# Altium project EEG.PrjPcb
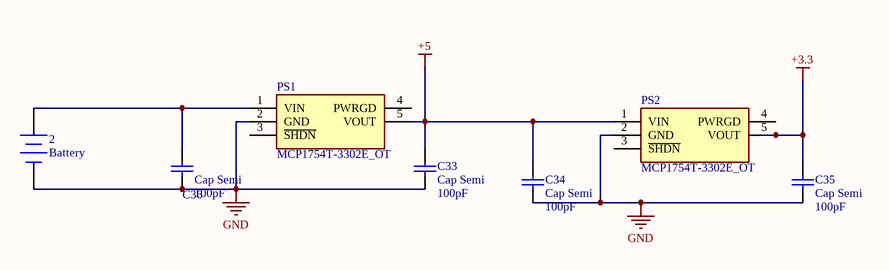
[diagram p0: Power.SchDoc]
3 sheets, 73 parts. Net scope: global (net labels, ports and power ports of the same name join across sheets).
Board file: PCB3.PcbDoc
Sheets:
  Power.SchDoc
  MCU.SchDoc
  ADS1299.schdoc

## Sheet Power.SchDoc
size A

### Parts
2  Battery  [BAT-2]
C33  Cap Semi  value 100pF  [0805c]
C34  Cap Semi  value 100pF  [0805c]
C35  Cap Semi  value 100pF  [0805c]
C36  Cap Semi  value 100pF  [0805c]
PS1  MCP1754T-3302E_OT  [SOT23-5]
PS2  MCP1754T-3302E_OT  [SOT23-5]

### Nets
+3.3: C35.1 PS2.5(VOUT)
+5: C33.1 C34.2 PS1.5(VOUT) PS2.1(VIN)
GND: 2.2(-) C33.2 C34.1 C35.2 C36.1 PS1.2(GND) PS2.2(GND)
Net2_1: 2.1(+) C36.2 PS1.1(VIN)

Not connected (* = marked no-connect by the designer): PS1 3(~{SHDN}) 4(PWRGD); PS2 3(~{SHDN}) 4(PWRGD)

### Library data of the parts
2 = Battery: Multicell Battery; Published: 24-Mar-1999; LatestRevisionDate: 17-Jul-2002; LatestRevisionNote: Re-released for DXP Platform.; PackageReference: BAT-2; Publisher: Altium Limited; PackageDescription: Battery; 2 Leads
C33-C36 = Cap Semi: Capacitor (Semiconductor SIM Model); Published: 8-Jun-2000; PackageReference: C1206; Publisher: Altium Limited; PackageDescription: Chip Capacitor; LatestRevisionDate: 29-May-2009; LatestRevisionNote: IPC-7351 Footprint Added.
PS1 PS2 = MCP1754T-3302E_OT: Power Supply; Manufacturer_Name: Microchip; Manufacturer_Part_Number: MCP1754T-3302E/OT; Allied_Number: 70451943; Datasheet Link: http://ww1.microchip.com/downloads/en/DeviceDoc/20002276C.pdf; Height: 1.45mm; Mouser Part Number: 579-MCP1754T3302EOT; Mouser Price/Stock: https://www.mouser.com/Search/Refine.aspx?Keyword=579-MCP1754T3302EOT; Allied Price/Stock: https://www.alliedelec.com/microchiptechnologyinc-mcp1754t-3302e-ot/70451943/

## Sheet MCU.SchDoc
size B
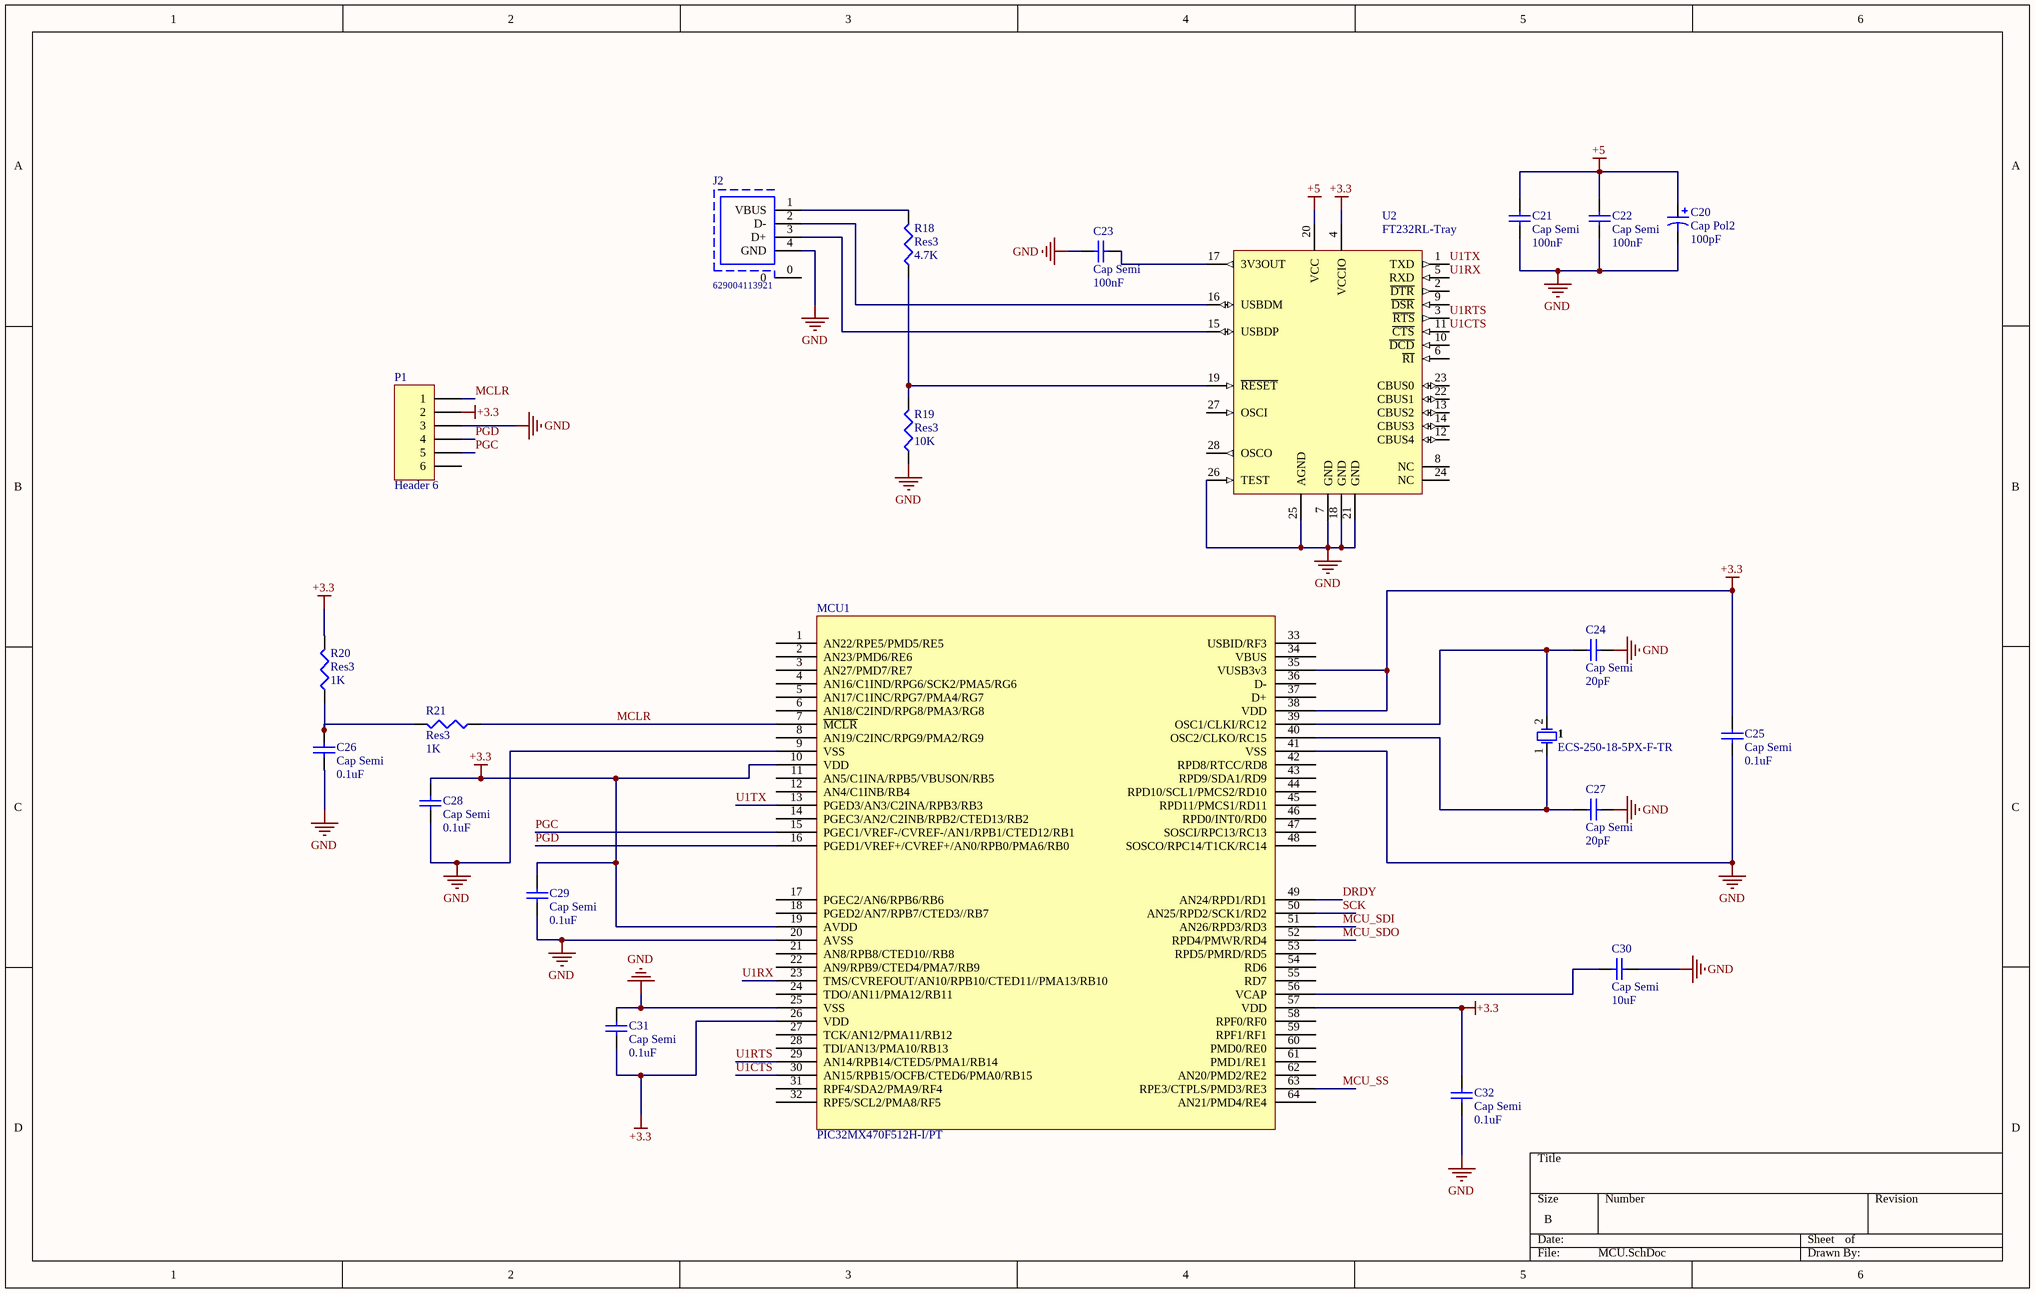
[diagram p1: MCU.SchDoc]

### Parts
1  ECS-250-18-5PX-F-TR  [XTAL/S]
C20  Cap Pol2  value 100pF  [φ6.5-1]
C21  Cap Semi  value 100nF  [0805c]
C22  Cap Semi  value 100nF  [0805c]
C23  Cap Semi  value 100nF  [0805c]
C24  Cap Semi  value 20pF  [0805c]
C25  Cap Semi  value 0.1uF  [0805c]
C26  Cap Semi  value 0.1uF  [0805c]
C27  Cap Semi  value 20pF  [0805c]
C28  Cap Semi  value 0.1uF  [0805c]
C29  Cap Semi  value 0.1uF  [0805c]
C30  Cap Semi  value 10uF  [0805c]
C31  Cap Semi  value 0.1uF  [0805c]
C32  Cap Semi  value 0.1uF  [0805c]
J2  629004113921  [USB-公头]
MCU1  PIC32MX470F512H-I/PT  [*QFP50P1200X1200X120-64N]
P1  Header 6  [HDR1X6]
R18  Res3  value 4.7K  [0805]
R19  Res3  value 10K  [0805]
R20  Res3  value 1K  [0805]
R21  Res3  value 1K  [0805]
U2  FT232RL-Tray  [SSOP-28]

### Nets
+3.3: C25.2 C28.2 C29.2 C31.1 C32.2 MCU1.10(VDD) MCU1.19(AVDD) MCU1.26(VDD) MCU1.35(VUSB3v3) MCU1.38(VDD) MCU1.57(VDD) P1.2 R20.2 U2.4(VCCIO)
+5: C20.1 C21.2 C22.2 U2.20(VCC)
GND: C20.2 C21.1 C22.1 C23.2 C24.2 C25.1 C26.1 C27.2 C28.1 C29.1 C30.2 C31.2 C32.1 J2.4(GND) MCU1.9(VSS) MCU1.20(AVSS) MCU1.25(VSS) MCU1.41(VSS) P1.3 R19.1 U2.7(GND) U2.18(GND) U2.21(GND) U2.25(AGND) U2.26(TEST)
DRDY: MCU1.49(AN24/RPD1/RD1)
MCLR: MCU1.7(~{MCLR}) P1.1 R21.1
MCU_SDI: MCU1.51(AN26/RPD3/RD3)
MCU_SDO: MCU1.52(RPD4/PMWR/RD4)
MCU_SS: MCU1.63(RPE3/CTPLS/PMD3/RE3)
PGC: MCU1.15(PGEC1/VREF-/CVREF-/AN1/RPB1/CTED12/RB1) P1.5
PGD: MCU1.16(PGED1/VREF+/CVREF+/AN0/RPB0/PMA6/RB0) P1.4
SCK: MCU1.50(AN25/RPD2/SCK1/RD2)
U1CTS: MCU1.30(AN15/RPB15/OCFB/CTED6/PMA0/RB15) U2.11(~{CTS})
U1RTS: MCU1.29(AN14/RPB14/CTED5/PMA1/RB14) U2.3(~{RTS})
U1RX: MCU1.23(TMS/CVREFOUT/AN10/RPB10/CTED11//PMA13/RB10) U2.5(RXD)
U1TX: MCU1.13(PGED3/AN3/C2INA/RPB3/RB3) U2.1(TXD)
Net1_1: 1.1 C27.1 MCU1.40(OSC2/CLKO/RC15)
Net1_2: 1.2 C24.1 MCU1.39(OSC1/CLKI/RC12)
NetC23_1: C23.1 U2.17(3V3OUT)
NetC26_2: C26.2 R20.1 R21.2
NetC30_1: C30.1 MCU1.56(VCAP)
NetJ2_1: J2.1(VBUS) R18.2
NetJ2_2: J2.2(D-) U2.16(USBDM)
NetJ2_3: J2.3(D+) U2.15(USBDP)
NetR18_1: R18.1 R19.2 U2.19(~{RESET})

Not connected (* = marked no-connect by the designer): J2 0; MCU1 1(AN22/RPE5/PMD5/RE5) 2(AN23/PMD6/RE6) 3(AN27/PMD7/RE7) 4(AN16/C1IND/RPG6/SCK2/PMA5/RG6) 5(AN17/C1INC/RPG7/PMA4/RG7) 6(AN18/C2IND/RPG8/PMA3/RG8) 8(AN19/C2INC/RPG9/PMA2/RG9) 11(AN5/C1INA/RPB5/VBUSON/RB5) 12(AN4/C1INB/RB4) 14(PGEC3/AN2/C2INB/RPB2/CTED13/RB2) 17(PGEC2/AN6/RPB6/RB6) 18(PGED2/AN7/RPB7/CTED3//RB7) 21(AN8/RPB8/CTED10//RB8) 22(AN9/RPB9/CTED4/PMA7/RB9) 24(TDO/AN11/PMA12/RB11) 27(TCK/AN12/PMA11/RB12) 28(TDI/AN13/PMA10/RB13) 31(RPF4/SDA2/PMA9/RF4) 32(RPF5/SCL2/PMA8/RF5) 33(USBID/RF3) 34(VBUS) 36(D-) 37(D+) 42(RPD8/RTCC/RD8) 43(RPD9/SDA1/RD9) 44(RPD10/SCL1/PMCS2/RD10) 45(RPD11/PMCS1/RD11) 46(RPD0/INT0/RD0) 47(SOSCI/RPC13/RC13) 48(SOSCO/RPC14/T1CK/RC14) 53(RPD5/PMRD/RD5) 54(RD6) 55(RD7) 58(RPF0/RF0) 59(RPF1/RF1) 60(PMD0/RE0) 61(PMD1/RE1) 62(AN20/PMD2/RE2) 64(AN21/PMD4/RE4); P1 6; U2 2(~{DTR}) 6(~{RI}) 8(NC) 9(~{DSR}) 10(~{DCD}) 12(CBUS4) 13(CBUS2) 14(CBUS3) 22(CBUS1) 23(CBUS0) 24(NC) 27(OSCI) 28(OSCO)

### Library data of the parts
1 = CMP-2000-05725-1: Low Profile Crystal, 14.7456 MHz, 18 pF, -20 to 70 degC, 2-Pin SMD, RoHS, Tape and Reel; Manufacturer: ABRACON; ESR: 50Ohms; Case Width: 4.7mm; Case Length: 11.4mm; Frequency Stability: 50PPM; Tolerance: 20PPM; Case Height: 4.2mm; Load Capacitance: 18pF; Datasheet URL: http://www.abracon.com/Resonators/abls.pdf; Package / Case: HC-49/US; Dimensions: 4.7mmWx11.4mmLx4.2mmH; Mounting Technology: SurfaceMount; RoHS: Details; Series: ABLS; Frequency: 14.7456MHz; Datasheet Version: 04/2011; Mounting Style: SMD/SMT; Packaging: Reel; Factory Pack Quantity: 1000; Product Category: Crystals; Package Reference: ABLS-14.7456MHZ-B2-T; Package URL: http://www.abracon.com/Support/PackageDrawing/Resonators/ABLS-2D.pdf; Manufacturer URL: http://www.abracon.com/; Package Description: 2-Pin Surface Mount Device, Body 11.4 x 4.7 mm; Termination Style: SMD/SMT; Operating Temperature Range: -20Cto+70C; Type: LowProfileMicroprocessorCrystal; Brand: ABRACON
C20 = Cap Pol2: Polarized Capacitor (Axial); Published: 8-Jun-2000; PackageReference: POLAR0.8; Publisher: Altium Limited; PackageDescription: Polarized Capacitor; 2 Leads; LatestRevisionDate: 17-Jul-2002; LatestRevisionNote: Re-released for DXP Platform.
C21-C32 = Cap Semi: Capacitor (Semiconductor SIM Model); Published: 8-Jun-2000; LatestRevisionDate: 29-May-2009; LatestRevisionNote: IPC-7351 Footprint Added.; PackageReference: C1206; Publisher: Altium Limited; PackageDescription: Chip Capacitor
J2 = CMP-1502-03242-1: USB 2.0 Type A Plug WR-COM, Horizontal, SMT, with Clips; Manufacturer: Wurth Elektronik; Contact Resistance: 20mOhm; Working Voltage: 30VAC; Rated Current: 1.5A; Packaging: Tube; Operating Temperature: -40to105degC; Manufacturer URL: http://www.we-online.de; Orientation: Horizontal; Datasheet URL: https://katalog.we-online.de/em/datasheet/629004113921.pdf; Package Reference: 629004113921; Mounting Technology: SMT; Gender: Plug; Publisher: WurthElektronik; Part Number: 629004113921; Connector Type: USB2.0TypeA
P1 = Header 6: Header, 6-Pin; LatestRevisionDate: 17-Jul-2002; LatestRevisionNote: Re-released for DXP Platform.; Publisher: Altium Limited
R18-R21 = Res3: Resistor; Published: 8-Jun-2000; LatestRevisionDate: 29-May-2009; LatestRevisionNote: IPC-7351 Footprint Added.; PackageReference: J1-0603; Publisher: Altium Limited; PackageDescription: Chip Resistor
U2 = COM-UART-FT232R-IL28: USB UART Asynchronous Serial Data Transfer Chip, SSOP-28, Tray; DatasheetVersion: ver 2.07, Jul-2010; PackageVersion: 2010; PackageReference: SSOP-28; PackageDescription: 28-Pin Small Outline Package 0.65 mm Pitch

## Sheet ADS1299.schdoc
size A4
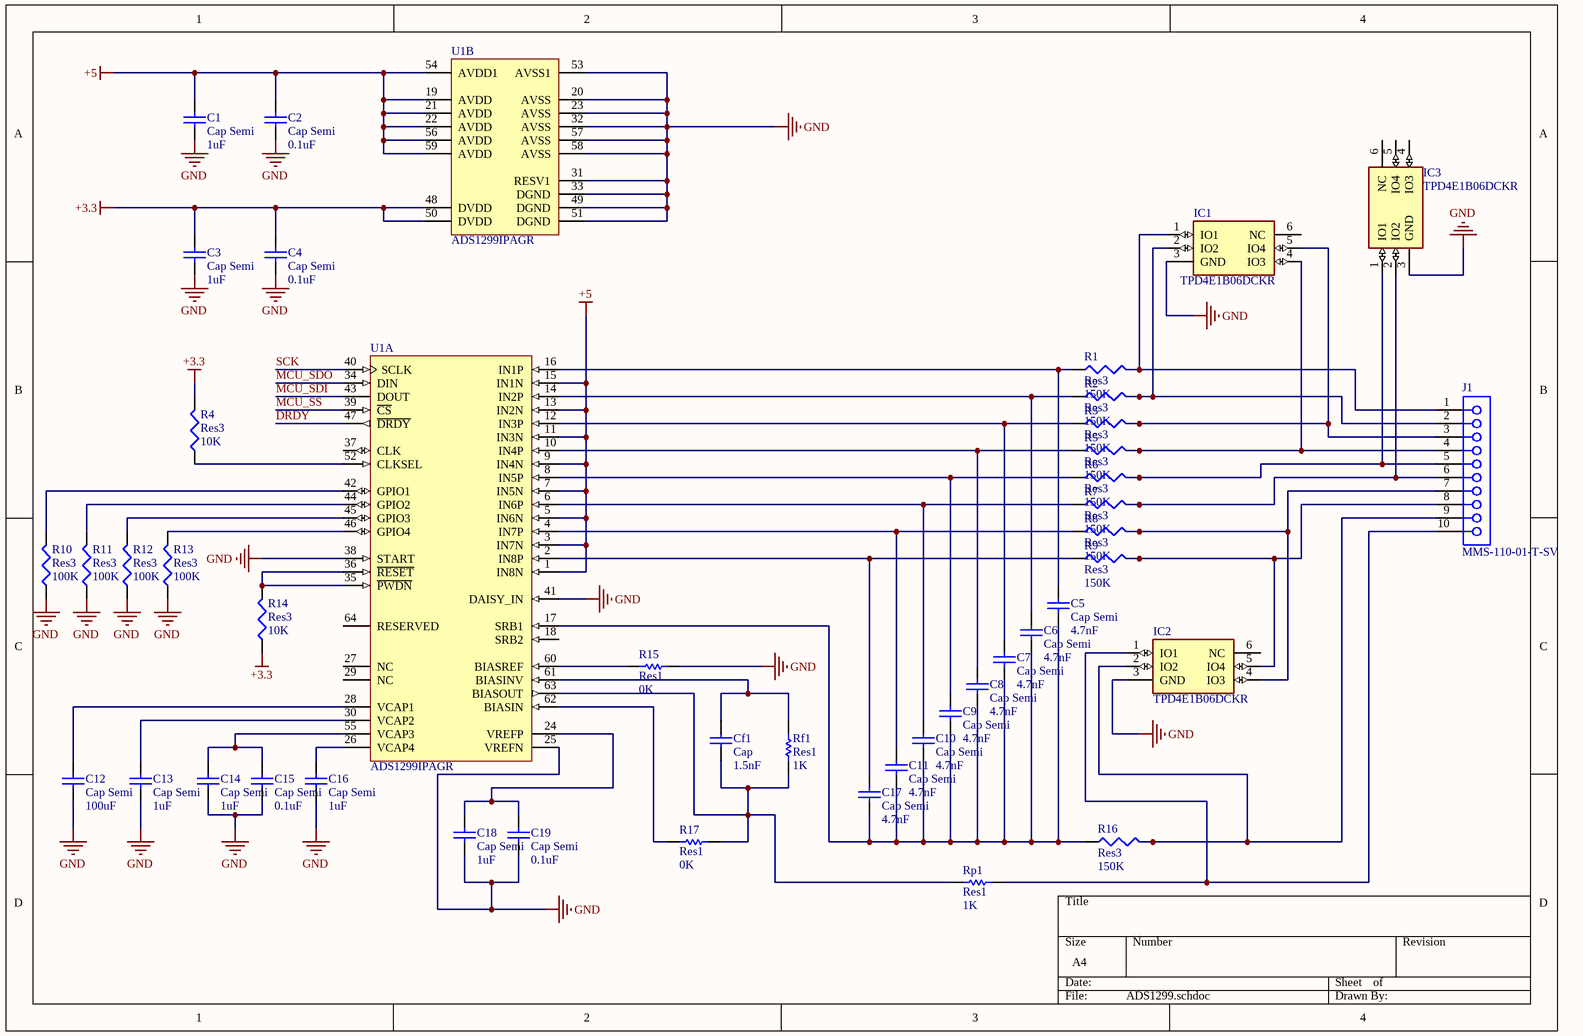
[diagram p2: ADS1299.schdoc]

### Parts
C1  Cap Semi  value 1uF  [0805c]
C2  Cap Semi  value 0.1uF  [0805c]
C3  Cap Semi  value 1uF  [0805c]
C4  Cap Semi  value 0.1uF  [0805c]
C5  Cap Semi  value 4.7nF  [0805c]
C6  Cap Semi  value 4.7nF  [0805c]
C7  Cap Semi  value 4.7nF  [0805c]
C8  Cap Semi  value 4.7nF  [0805c]
C9  Cap Semi  value 4.7nF  [0805c]
C10  Cap Semi  value 4.7nF  [0805c]
C11  Cap Semi  value 4.7nF  [0805c]
C12  Cap Semi  value 100uF  [0805c]
C13  Cap Semi  value 1uF  [0805c]
C14  Cap Semi  value 1uF  [0805c]
C15  Cap Semi  value 0.1uF  [0805c]
C16  Cap Semi  value 1uF  [0805c]
C17  Cap Semi  value 4.7nF  [0805c]
C18  Cap Semi  value 1uF  [0805c]
C19  Cap Semi  value 0.1uF  [0805c]
Cf1  Cap  value 1.5nF  [102]
IC1  TPD4E1B06DCKR  [SOT363]
IC2  TPD4E1B06DCKR  [SOT363]
IC3  TPD4E1B06DCKR  [SOT363]
J1  MMS-110-01-T-SV  [HDR1X10]
R1  Res3  value 150K  [0805]
R2  Res3  value 150K  [0805]
R3  Res3  value 150K  [0805]
R4  Res3  value 10K  [0805]
R5  Res3  value 150K  [0805]
R6  Res3  value 150K  [0805]
R7  Res3  value 150K  [0805]
R8  Res3  value 150K  [0805]
R9  Res3  value 150K  [0805]
R10  Res3  value 100K  [0805]
R11  Res3  value 100K  [0805]
R12  Res3  value 100K  [0805]
R13  Res3  value 100K  [0805]
R14  Res3  value 10K  [0805]
R15  Res1  value 0K  [RB0.4    &9]
R16  Res3  value 150K  [0805]
R17  Res1  value 0K  [RB0.4    &9]
Rf1  Res1  value 1K  [RB0.4    &9]
Rp1  Res1  value 1K  [RB0.4    &9]
U1  ADS1299IPAGR  [PAG0064A_M]  (parts A,B of 2)

### Nets
+3.3: C3.2 C4.2 R4.2 R14.1 U1.48(DVDD) U1.50(DVDD)
+5: C1.2 C2.2 U1.1(IN8N) U1.3(IN7N) U1.5(IN6N) U1.7(IN5N) U1.9(IN4N) U1.11(IN3N) U1.13(IN2N) U1.15(IN1N) U1.19(AVDD) U1.21(AVDD) U1.22(AVDD) U1.54(AVDD1) U1.56(AVDD) U1.59(AVDD)
GND: C1.1 C2.1 C3.1 C4.1 C12.1 C13.1 C14.1 C15.1 C16.1 C18.1 C19.1 IC1.3(GND) IC2.3(GND) IC3.3(GND) R10.1 R11.1 R12.1 R13.1 R15.1 U1.20(AVSS) U1.23(AVSS) U1.25(VREFN) U1.31(RESV1) U1.32(AVSS) U1.33(DGND) U1.38(START) U1.41(DAISY_IN) U1.49(DGND) U1.51(DGND) U1.53(AVSS1) U1.57(AVSS) U1.58(AVSS)
DRDY: U1.47(~{DRDY})
MCU_SDI: U1.43(DOUT)
MCU_SDO: U1.34(DIN)
MCU_SS: U1.39(~{CS})
SCK: U1.40(SCLK)
NetC5_1: C5.1 C6.1 C7.1 C8.1 C9.1 C10.1 C11.1 C17.1 R16.1 U1.17(SRB1)
NetC5_2: C5.2 R1.1 U1.16(IN1P)
NetC6_2: C6.2 R2.1 U1.14(IN2P)
NetC7_2: C7.2 R3.1 U1.12(IN3P)
NetC8_2: C8.2 R5.1 U1.10(IN4P)
NetC9_2: C9.2 R6.1 U1.8(IN5P)
NetC10_2: C10.2 R7.1 U1.6(IN6P)
NetC11_2: C11.2 R8.1 U1.4(IN7P)
NetC12_2: C12.2 U1.28(VCAP1)
NetC13_2: C13.2 U1.30(VCAP2)
NetC14_2: C14.2 C15.2 U1.55(VCAP3)
NetC16_2: C16.2 U1.26(VCAP4)
NetC17_2: C17.2 R9.1 U1.2(IN8P)
NetC18_2: C18.2 C19.2 U1.24(VREFP)
NetCf1_1: Cf1.1 R17.2 Rf1.1 Rp1.1 U1.63(BIASOUT)
NetCf1_2: Cf1.2 Rf1.2 U1.61(BIASINV)
NetIC1_1: IC1.1(IO1) J1.1 R1.2
NetIC1_2: IC1.2(IO2) J1.2 R2.2
NetIC1_4: IC1.4(IO3) J1.4 R5.2
NetIC1_5: IC1.5(IO4) J1.3 R3.2
NetIC2_1: IC2.1(IO1) J1.10 Rp1.2
NetIC2_2: IC2.2(IO2) J1.9 R16.2
NetIC2_4: IC2.4(IO3) J1.7 R8.2
NetIC2_5: IC2.5(IO4) J1.8 R9.2
NetIC3_1: IC3.1(IO1) J1.5 R6.2
NetIC3_2: IC3.2(IO2) J1.6 R7.2
NetR4_1: R4.1 U1.52(CLKSEL)
NetR10_2: R10.2 U1.42(GPIO1)
NetR11_2: R11.2 U1.44(GPIO2)
NetR12_2: R12.2 U1.45(GPIO3)
NetR13_2: R13.2 U1.46(GPIO4)
NetR14_2: R14.2 U1.35(~{PWDN}) U1.36(~{RESET})
NetR15_2: R15.2 U1.60(BIASREF)
NetR17_1: R17.1 U1.62(BIASIN)

Not connected (* = marked no-connect by the designer): IC1 6(NC); IC2 6(NC); IC3 4(IO3) 5(IO4) 6(NC); U1 18(SRB2) 27(NC) 29(NC) 37(CLK) 64(RESERVED)

### Library data of the parts
C1-C19 = Cap Semi: Capacitor (Semiconductor SIM Model); Published: 8-Jun-2000; LatestRevisionDate: 29-May-2009; LatestRevisionNote: IPC-7351 Footprint Added.; PackageReference: C1206; Publisher: Altium Limited; PackageDescription: Chip Capacitor
Cf1 = Cap: Capacitor; Published: 8-Jun-2000; LatestRevisionDate: 17-Jul-2002; LatestRevisionNote: Re-released for DXP Platform.; PackageReference: RAD-0.3; Publisher: Altium Limited; PackageDescription: Radial Cap, Thru-Hole; 2 Leads; 0.3 in Pin Spacing
IC1-IC3 = TPD4E1B06DCKR: Integrated Circuit; Manufacturer_Name: Texas Instruments; Datasheet Link: http://www.ti.com/jp/lit/gpn/tpd4e1b06; Height: 1.1mm; Manufacturer_Part_Number: TPD4E1B06DCKR; Mouser Part Number: 595-TPD4E1B06DCKR; Mouser Price/Stock: https://www.mouser.com/Search/Refine.aspx?Keyword=595-TPD4E1B06DCKR; RS Part Number: 8255330P; RS Price/Stock: http://uk.rs-online.com/web/p/products/8255330P
J1 = CMP-1022-00092-1: Tiger Claw(TM) Socket Strip, Through-hole, Vertical, -55 to 105 degC, 2 mm Pitch, 10-Pin, Female, RoHS; Manufacturer: Samtec; Pitch: 2 mm; RoHS: True; Orientation: Vertical; PackageDescription: 2mm Through Hole Box Connector Strip Assembly; Mounting Technology: Through-hole; ComponentLink3Description: Package Specification; DatasheetVersion: F-214; PackageReference: MMS-110-01-X-SV; PackageVersion: AO, 2/1993; ComponentLink2Description: Datasheet; ComponentLink3URL: http://www.samtec.com/documents/webfiles/cpdf/MMS-1XX-01-XXX-XX-XXX-MKT1.pdf; Temperature Range: -55 to 105 degC; ComponentLink1URL: http://www.samtec.com; PartNumber: MMS-110-01-T-SV; ComponentLink1Description: Manufacturer URL; ComponentLink2URL: http://www.samtec.com/documents/webfiles/pdf/MMS.PDF
R1-R14 R16 = Res3: Resistor; Published: 8-Jun-2000; LatestRevisionDate: 29-May-2009; LatestRevisionNote: IPC-7351 Footprint Added.; PackageReference: J1-0603; Publisher: Altium Limited; PackageDescription: Chip Resistor
R15 R17 Rf1 Rp1 = Res1: Resistor; PackageDescription: Axial Device, Thru-Hole; 2 Leads; 0.3 in Pin Spacing; PackageReference: AXIAL-0.3; Published: 8-Jun-2000; LatestRevisionDate: 17-Jul-2002; LatestRevisionNote: Re-released for DXP Platform.; Publisher: Altium Limited
U1 = CMP-0841-00001-2: Low-Noise, 8-Channel, 24-Bit Analog Front-End for Biopotential Measurement, 16 KSPS, -40 to 85 degC, 64-Pin PQFP (PAG-64), RoHS, Tape and Reel; Manufacturer: Texas Instruments; Architecture: Delta-Sigma; Interface: Serial SPI; # Input Channels: 8; Sample Rate (max) (KSPS): 16; Packing: PAG0064A; Reference Mode: Int, Ext; Resolution (Bits): 24; PackageReference: PAG-64; ComponentLink2Description: Datasheet; Operating Temperature Range (C): -40 to 85; ComponentLink1Description: Manufacturer URL; Mounting Technology: Surface Mount; ComponentLink3Description: Package Specification; PartNumber: ADS1299IPAGR; PackageDescription: 64-Pin Plastic Quad Flatpack, Body 10 x 10 mm, Pitch 0.5 mm; ComponentLink2URL: http://www.ti.com/lit/ds/symlink/ads1299.pdf; PackageVersion: 4040282/C; ComponentLink1URL: http://www.ti.com/; ComponentLink3URL: http://www.ti.com/lit/ml/mtqf006a/mtqf006a.pdf; RoHS: TRUE; DatasheetVersion: SBAS499A

## Nets that join several sheets
+3.3: Power (C35.1 PS2.5), MCU (14 pins), ADS1299 (6 pins)
+5: Power (C33.1 C34.2 PS1.5 PS2.1), MCU (C20.1 C21.2 C22.2 U2.20), ADS1299 (16 pins)
GND: Power (7 pins), MCU (25 pins), ADS1299 (32 pins)
DRDY: MCU (MCU1.49), ADS1299 (U1.47)
MCU_SDI: MCU (MCU1.51), ADS1299 (U1.43)
MCU_SDO: MCU (MCU1.52), ADS1299 (U1.34)
MCU_SS: MCU (MCU1.63), ADS1299 (U1.39)
SCK: MCU (MCU1.50), ADS1299 (U1.40)